# Altium schematic sheet POWER RAIL.SchDoc: ETHERNET SWITCH LAYER 2
size A4; DrawnBy: Luca Schenetti; Revision: C; SheetNumber: 2; SheetTotal: 5
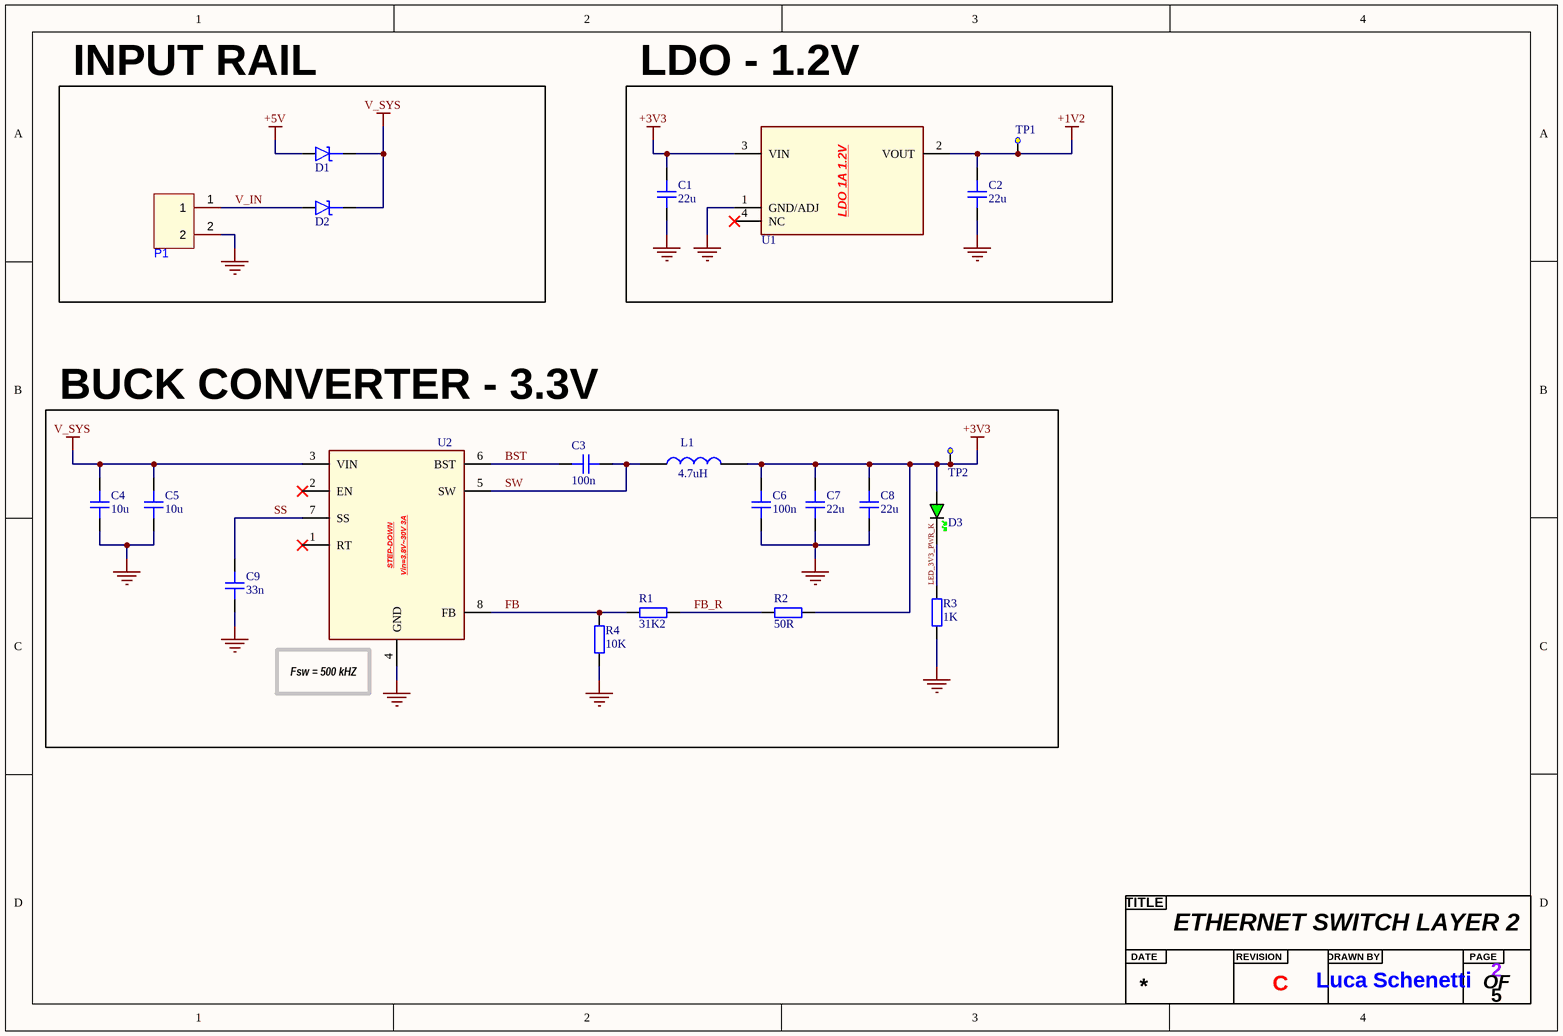
[diagram p0: POWER RAIL.SchDoc]

## Parts
?  Title  (value not drawn)  (graphical)
C1  22u  [CAP_1206]
C2  22u  [CAP_1206]
C3  100n  [CAP_0603]
C4  10u  [CAP_0805]
C5  10u  [CAP_0805]
C6  100n  [CAP_0603]
C7  22u  [CAP_0603]
C8  22u  [CAP_0603]
C9  33n  [CAP_0603]
D1  40V 3A SMA(DO-214AC)  [SS34]  (value not drawn)
D2  40V 3A SMA(DO-214AC)  [SS34]  (value not drawn)
D3  GREEN  [LED_0603_GREEN]  (value not drawn)
L1  4.7uH  [FXL0530-4R7-M]
P1  WJ500V-5.08-2P  [CONN-TH_2P-P5.00_WJ500V-5.08-2P]  (value not drawn)
R1  31K2  [RES_0603]
R2  50R  [RES_0603]
R3  1K  [RES_0402]
R4  10K  [RES_0603]
TP1  Test Point  [Test Point]  (value not drawn)
TP2  Test Point  [Test Point]  (value not drawn)
U1  LDO 1A 1.2V  [AMS1117-1.2]  (value not drawn)
U2  Step Down Converter 3A 3.8V~30V  [TPS62933DRLR]  (value not drawn)

## Blocks framed on the sheet
BUCK CONVERTER - 3.3V: C3-C9 D3 L1 R1-R4 TP2 U2

## Nets
+1V2: C2.2 TP1.1(Test_Point) U1.2(VOUT)
+3V3: C1.2 C6.1 C7.2 C8.2 D3.A L1.2 R2.1 TP2.1(Test_Point) U1.3(VIN)
+5V: D1.A
GND: C1.1 C2.1 C4.1 C5.1 C6.2 C7.1 C8.1 C9.2 P1.2 R3.1 R4.1 U1.1(GND/ADJ) U2.4(GND)
V_SYS: C4.2 C5.2 D1.K D2.K U2.3(VIN)
BST: C3.2 U2.6(BST)
FB: R1.2 R4.2 U2.8(FB)
FB_R: R1.1 R2.2
LED_3V3_PWR_K: D3.K R3.2
SS: C9.1 U2.7(SS)
SW: C3.1 L1.1 U2.5(SW)
V_IN: D2.A P1.1

Not connected (* = marked no-connect by the designer): U1 4(NC)*; U2 1(RT)* 2(EN)*

## Notes on the sheet
- INPUT RAIL
- LDO - 1.2V
- (near U2) Fsw = 500 kHZ
- (in symbol Title) TITLE; DATE; REVISION; DRAWN BY; PAGE; OF
- (in symbol TPS62933DRLR) STEP-DOWN; Vin=3.8V~30V 3A

## Library data of the parts
C1 C2 = CAP_1206: [C12891]; Manufacturer: *; Manufacturer Part Number: *; Distributor Link: *; LCSC: *; Rating: *; Dielectric: *
C3 C6 = CAP_0603: Capacitor SMD 0603 [C14663]; Manufacturer: *; Manufacturer Part Number: *; Distributor Link: *; LCSC: *; Rating: *; Dielectric: *
C4 C5 = CAP_0805: Capacitor SMD 0805[C440198]; Manufacturer: *; Manufacturer Part Number: *; Distributor Link: *; LCSC: *; Rating: *; Dielectric: *
C7 C8 = CAP_0603: Capacitor SMD 0603 [C59461]; Manufacturer: *; Manufacturer Part Number: *; Distributor Link: *; LCSC: *; Rating: *; Dielectric: *
C9 = CAP_0603: [C21117]; Manufacturer: *; Manufacturer Part Number: *; Distributor Link: *; LCSC: *; Rating: *; Dielectric: *
D1 D2 = SS34: [C8678]
D3 = LED_0603_GREEN: LED 0603 GREEN SMD[C2986059]
L1 = FXL0530-4R7-M: [C177246]
P1 = WJ500V-5.08-2P: [C8465]; Manufacturer: KANGNEX(康奈克斯电气); Symbol: WJ500V-5.08-2P-14-00A; Add into BOM: yes; Structure: 1x2P; Pitch: 5.08mm; Current Rating (Max): 18A; Voltage Rating (Max): 250V; Wire Gauge - AWG: 14~30; Wire Gauge - mm2: 2.5; Number of PINs Per Row: 2; Screw Specification: M2.5; Device: WJ500V-5.08-2P; LCSC Part Name: 1x2P 5.08mm 直插 排数:1 每排P数:2; Supplier Part: C8465; Manufacturer Part: WJ500V-5.08-2P; Supplier Footprint: 插件,P=5.08mm; JLCPCB Part Class: Extended Part; Datasheet: https://atta.szlcsc.com/upload/public/pdf/source/20191225/C8465_02D34CE5B5B4A53DF5891601D97FA9F4.pdf; Supplier: LCSC; Convert to PCB: yes; Color: Green; Mounting Style: Straight; Number of Pins: 2P; Number of Rows: 1; Contact Material: -; Contact Plating: -; Operating Temperature Range: -40℃~+105℃; Soldering Temperature(Max): -
R1 = RES_0603: [C863036]; Manufacturer: *; Manufacturer Part Number: *; Distributor Link: *; LCSC: *
R2 = RES_0603: [C849792]; Manufacturer: *; Manufacturer Part Number: *; Distributor Link: *; LCSC: *
R3 = RES_0402: Resistor SMD 0402 [C11702]; Manufacturer: *; Manufacturer Part Number: *; Distributor Link: *; LCSC: *
R4 = RES_0603: [C25804]; Manufacturer: *; Manufacturer Part Number: *; Distributor Link: *; LCSC: *
U1 = AMS1117-1.2: [C347218]
U2 = TPS62933DRLR: [C3200405]
TP1 TP2 = Test Point: Value: Test Point